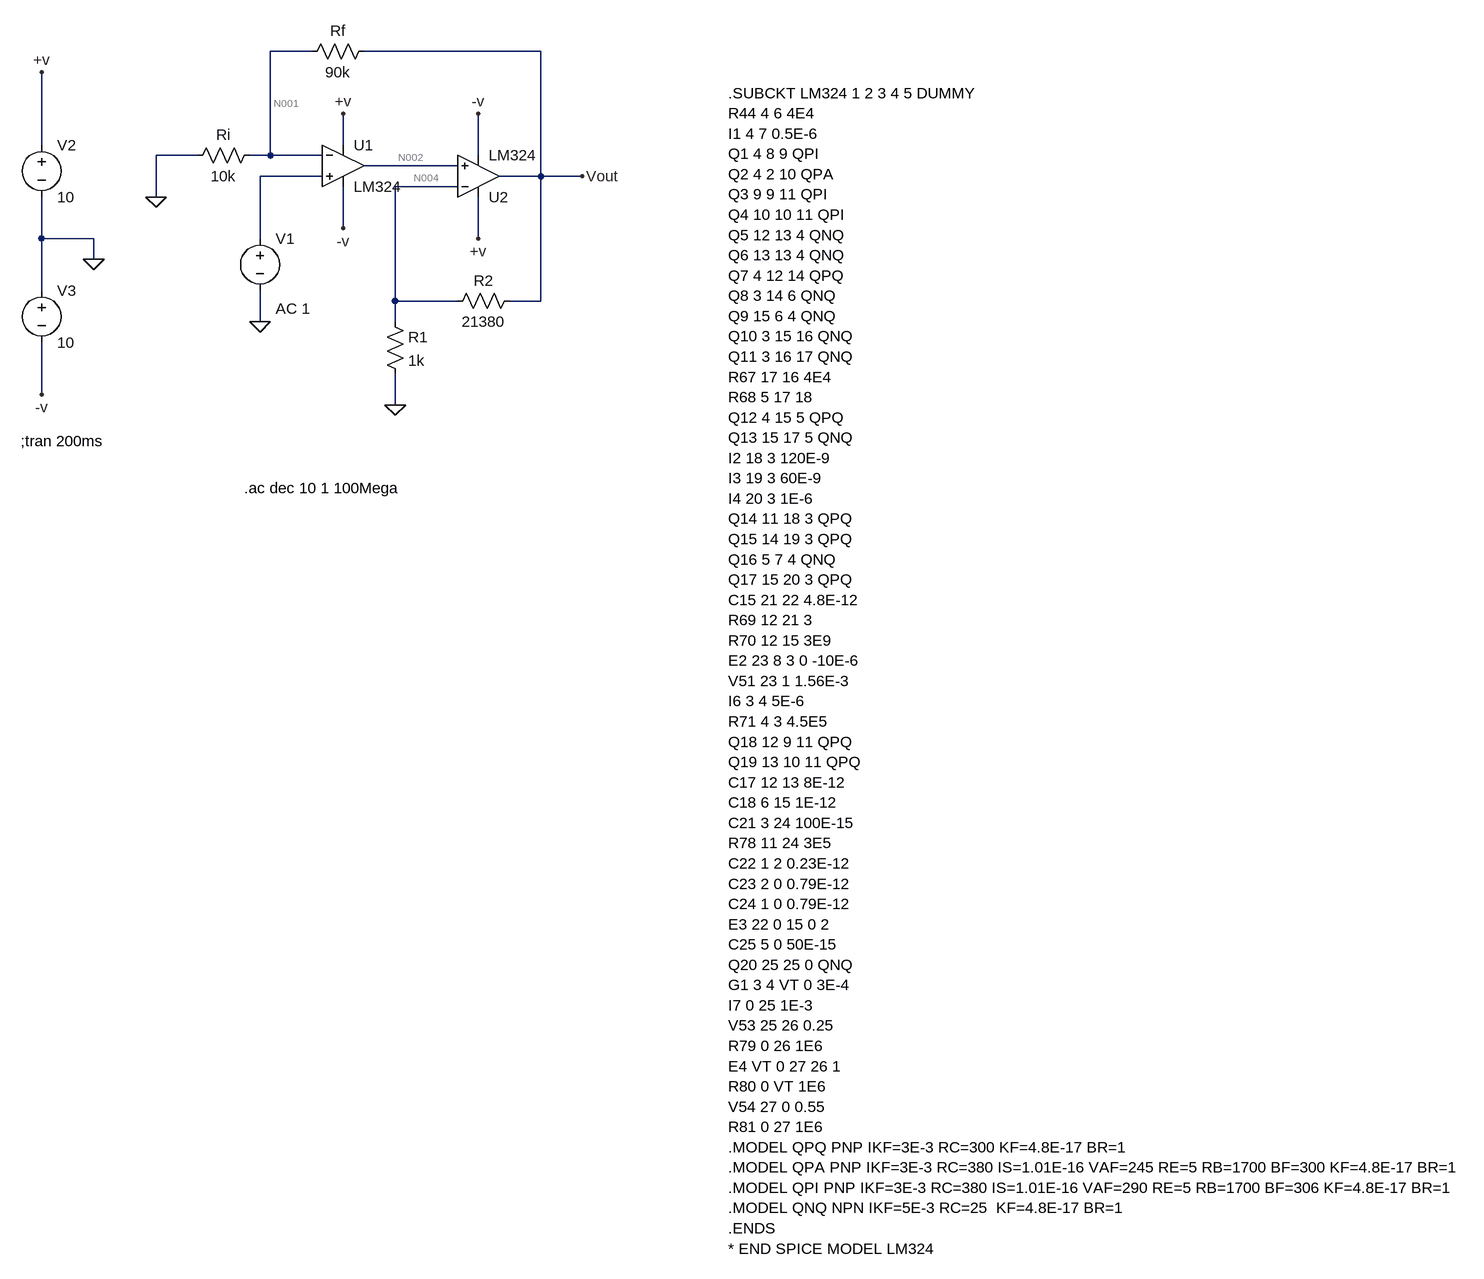
[diagram p0: schematic Laboratorio n° 3 - Circuito 1.asc]
Laboratorio n° 3 - Circuito 1.asc, the LTspice schematic file:
Version 4
SHEET 1 2092 1676
WIRE 256 0 192 0
WIRE 608 0 336 0
WIRE -160 144 -160 32
WIRE 304 144 304 96
WIRE 80 160 16 160
WIRE 192 160 192 0
WIRE 192 160 160 160
WIRE 272 160 192 160
WIRE 512 160 512 96
WIRE 480 176 336 176
WIRE 272 192 176 192
WIRE 608 192 608 0
WIRE 608 192 544 192
WIRE 672 192 608 192
WIRE 480 208 384 208
WIRE 16 224 16 160
WIRE 304 272 304 208
WIRE -160 288 -160 224
WIRE -80 288 -160 288
WIRE 176 288 176 192
WIRE 512 288 512 224
WIRE -80 320 -80 288
WIRE -160 368 -160 288
WIRE 384 384 384 208
WIRE 480 384 384 384
WIRE 608 384 608 192
WIRE 608 384 560 384
WIRE 176 416 176 368
WIRE 384 416 384 384
WIRE -160 528 -160 448
WIRE 384 544 384 496
FLAG 384 544 0
FLAG 16 224 0
FLAG 672 192 Vout
FLAG 176 416 0
FLAG -80 320 0
FLAG -160 528 -v
FLAG -160 32 +v
FLAG 512 288 +v
FLAG 304 272 -v
FLAG 512 96 -v
FLAG 304 96 +v
SYMBOL OpAmps\\UniversalOpAmp 304 176 R0
SYMATTR InstName U1
SYMATTR Value LM324
SYMBOL res 176 144 R90
WINDOW 0 0 56 VBottom 2
WINDOW 3 32 56 VTop 2
SYMATTR InstName Ri
SYMATTR Value 10k
SYMBOL res 352 -16 R90
WINDOW 0 0 56 VBottom 2
WINDOW 3 32 56 VTop 2
SYMATTR InstName Rf
SYMATTR Value 90k
SYMBOL OpAmps\\UniversalOpAmp 512 192 M180
SYMATTR InstName U2
SYMATTR Value LM324
SYMBOL res 368 400 R0
SYMATTR InstName R1
SYMATTR Value 1k
SYMBOL res 576 368 R90
WINDOW 0 0 56 VBottom 2
WINDOW 3 32 56 VTop 2
SYMATTR InstName R2
SYMATTR Value 21380
SYMBOL voltage 176 272 R0
WINDOW 123 24 124 Left 2
WINDOW 39 0 0 Left 0
SYMATTR Value2 AC 1
SYMATTR InstName V1
SYMATTR Value ""
SYMBOL voltage -160 128 R0
WINDOW 123 0 0 Left 0
WINDOW 39 0 0 Left 0
SYMATTR InstName V2
SYMATTR Value 10
SYMBOL voltage -160 352 R0
WINDOW 123 0 0 Left 0
WINDOW 39 0 0 Left 0
SYMATTR InstName V3
SYMATTR Value 10
TEXT -192 600 Left 2 !;tran 200ms
TEXT 896 64 Left 2 !.SUBCKT LM324 1 2 3 4 5 DUMMY\nR44 4 6 4E4\nI1 4 7 0.5E-6\nQ1 4 8 9 QPI\nQ2 4 2 10 QPA\nQ3 9 9 11 QPI\nQ4 10 10 11 QPI\nQ5 12 13 4 QNQ\nQ6 13 13 4 QNQ\nQ7 4 12 14 QPQ\nQ8 3 14 6 QNQ\nQ9 15 6 4 QNQ\nQ10 3 15 16 QNQ\nQ11 3 16 17 QNQ\nR67 17 16 4E4\nR68 5 17 18\nQ12 4 15 5 QPQ\nQ13 15 17 5 QNQ\nI2 18 3 120E-9\nI3 19 3 60E-9\nI4 20 3 1E-6\nQ14 11 18 3 QPQ\nQ15 14 19 3 QPQ\nQ16 5 7 4 QNQ\nQ17 15 20 3 QPQ\nC15 21 22 4.8E-12\nR69 12 21 3\nR70 12 15 3E9\nE2 23 8 3 0 -10E-6\nV51 23 1 1.56E-3\nI6 3 4 5E-6\nR71 4 3 4.5E5\nQ18 12 9 11 QPQ\nQ19 13 10 11 QPQ\nC17 12 13 8E-12\nC18 6 15 1E-12\nC21 3 24 100E-15\nR78 11 24 3E5\nC22 1 2 0.23E-12\nC23 2 0 0.79E-12\nC24 1 0 0.79E-12\nE3 22 0 15 0 2\nC25 5 0 50E-15\nQ20 25 25 0 QNQ\nG1 3 4 VT 0 3E-4\nI7 0 25 1E-3\nV53 25 26 0.25\nR79 0 26 1E6\nE4 VT 0 27 26 1\nR80 0 VT 1E6\nV54 27 0 0.55\nR81 0 27 1E6\n.MODEL QPQ PNP IKF=3E-3 RC=300 KF=4.8E-17 BR=1\n.MODEL QPA PNP IKF=3E-3 RC=380 IS=1.01E-16 VAF=245 RE=5 RB=1700 BF=300 KF=4.8E-17 BR=1\n.MODEL QPI PNP IKF=3E-3 RC=380 IS=1.01E-16 VAF=290 RE=5 RB=1700 BF=306 KF=4.8E-17 BR=1\n.MODEL QNQ NPN IKF=5E-3 RC=25  KF=4.8E-17 BR=1\n.ENDS\n* END SPICE MODEL LM324
TEXT 152 672 Left 2 !.ac dec 10 1 100Mega

The netlist it stands for:
* Laboratorio n° 3 - Circuito 1.asc
XU1 N003 N001 +v -v N002 level1 LM324 Avol=1Meg GBW=10Meg Vos=0 En=0 Enk=0 In=0 Ink=0 Rin=500Meg  ; pins In+ In- V+ V- OUT
Ri N001 0 10k
Rf Vout N001 90k
XU2 N002 N004 +v -v Vout level1 LM324 Avol=1Meg GBW=10Meg Vos=0 En=0 Enk=0 In=0 Ink=0 Rin=500Meg  ; pins In+ In- V+ V- OUT
R1 N004 0 1k
R2 Vout N004 21380
V1 N003 0 AC 1
V2 +v 0 10
V3 0 -v 10
;tran 200ms
.SUBCKT LM324 1 2 3 4 5 DUMMY
R44 4 6 4E4
I1 4 7 0.5E-6
Q1 4 8 9 QPI
Q2 4 2 10 QPA
Q3 9 9 11 QPI
Q4 10 10 11 QPI
Q5 12 13 4 QNQ
Q6 13 13 4 QNQ
Q7 4 12 14 QPQ
Q8 3 14 6 QNQ
Q9 15 6 4 QNQ
Q10 3 15 16 QNQ
Q11 3 16 17 QNQ
R67 17 16 4E4
R68 5 17 18
Q12 4 15 5 QPQ
Q13 15 17 5 QNQ
I2 18 3 120E-9
I3 19 3 60E-9
I4 20 3 1E-6
Q14 11 18 3 QPQ
Q15 14 19 3 QPQ
Q16 5 7 4 QNQ
Q17 15 20 3 QPQ
C15 21 22 4.8E-12
R69 12 21 3
R70 12 15 3E9
E2 23 8 3 0 -10E-6
V51 23 1 1.56E-3
I6 3 4 5E-6
R71 4 3 4.5E5
Q18 12 9 11 QPQ
Q19 13 10 11 QPQ
C17 12 13 8E-12
C18 6 15 1E-12
C21 3 24 100E-15
R78 11 24 3E5
C22 1 2 0.23E-12
C23 2 0 0.79E-12
C24 1 0 0.79E-12
E3 22 0 15 0 2
C25 5 0 50E-15
Q20 25 25 0 QNQ
G1 3 4 VT 0 3E-4
I7 0 25 1E-3
V53 25 26 0.25
R79 0 26 1E6
E4 VT 0 27 26 1
R80 0 VT 1E6
V54 27 0 0.55
R81 0 27 1E6
.MODEL QPQ PNP IKF=3E-3 RC=300 KF=4.8E-17 BR=1
.MODEL QPA PNP IKF=3E-3 RC=380 IS=1.01E-16 VAF=245 RE=5 RB=1700 BF=300 KF=4.8E-17 BR=1
.MODEL QPI PNP IKF=3E-3 RC=380 IS=1.01E-16 VAF=290 RE=5 RB=1700 BF=306 KF=4.8E-17 BR=1
.MODEL QNQ NPN IKF=5E-3 RC=25  KF=4.8E-17 BR=1
.ENDS
* END SPICE MODEL LM324
.ac dec 10 1 100Mega
.lib UniversalOpAmp1.lib
.backanno
.end

* Results of the author's LTspice run, read from the files saved beside the schematic
* Operating Point, zero values left out:
*   V(-v) = -10 V
*   V(n001) = -288.5 µV
*   V(+v) = 10 V
*   V(n002) = 129.4 µV
*   V(vout) = -3.771 mV
*   V(n004) = -159.1 µV
*   I(Ri) = -28.85 nA
*   I(Rf) = -38.69 nA
*   I(R1) = -159.1 nA
*   I(R2) = -168.9 nA
*   I(V1) = 9.319 nA
*   I(V2) = -477.1 µA
*   I(V3) = -477.3 µA
*   Ix(u1:1) = -9.319 nA
*   Ix(u1:2) = -9.84 nA
*   Ix(u1:3) = 238.7 µA
*   Ix(u1:4) = -238.7 µA
*   Ix(u1:5) = 9.319 nA
*   Ix(u2:1) = -9.319 nA
*   Ix(u2:2) = -9.84 nA
*   Ix(u2:3) = 238.5 µA
*   Ix(u2:4) = -238.7 µA
*   Ix(u2:5) = 207.6 nA
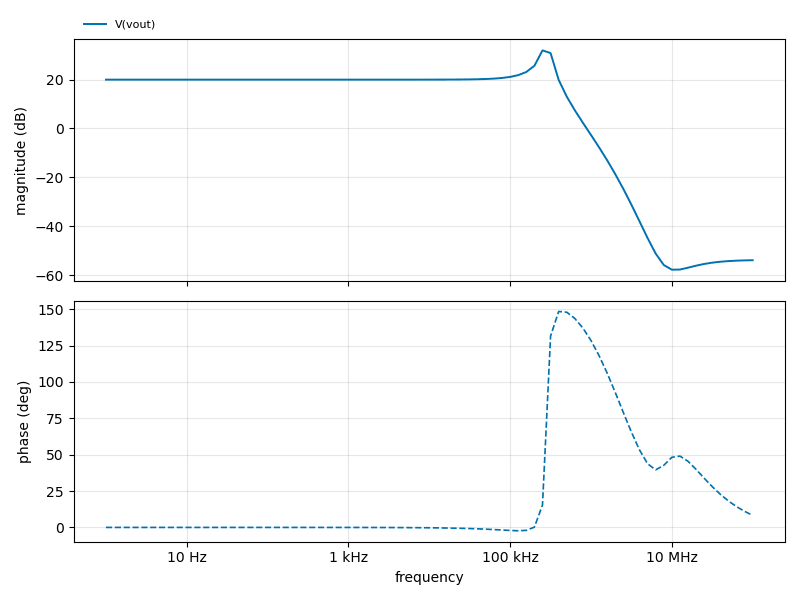
[diagram p1: AC Analysis of Laboratorio n° 3 - Circuito 1.asc, plotted from the saved traces]
* AC Analysis, 1 run:
*   V(vout): 20.00 dB at 1 Hz, -53.92 dB at 100 MHz, peak 31.97 dB at 251.2 kHz, 3 dB below the peak at 225 kHz and 329.2 kHz